# Altium schematic sheet CD4051BM_TR1_CD4051BM_TR.schdoc
size 124 x 99 mm
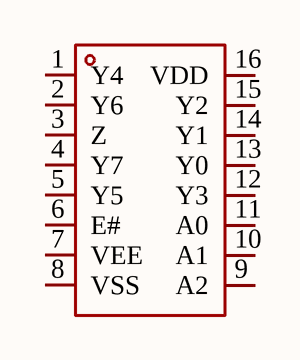
[diagram p0: CD4051BM_TR1_CD4051BM_TR.schdoc]

## Parts
U?  CD4051BM/TR  [SOP-16_L9.9-W3.9-P1.27-LS6.1-BL]  (value not drawn)

## Nets

Not connected (* = marked no-connect by the designer): U? 1(Y4) 2(Y6) 3(Z) 4(Y7) 5(Y5) 6(E#) 7(VEE) 8(VSS) 9(A2) 10(A1) 11(A0) 12(Y3) 13(Y0) 14(Y1) 15(Y2) 16(VDD)

## Library data of the parts
U? = CD4051BM/TR: Manufacturer: HGSEMI(华冠); Add into BOM: yes; Switch Circuit: 单刀八掷(SP8T); Number of Channels: 8; Supply Voltage: 3V~15V; On-State Resistance (Max): 60Ω; Symbol: CD4051BM/TR; Device: CD4051BM/TR; LCSC Part Name: CD4051B 单刀八掷模拟开关; Supplier Part: C507163; Manufacturer Part: CD4051BM/TR; Supplier Footprint: SOP-16; JLCPCB Part Class: Extended Part; Datasheet: https://atta.szlcsc.com/upload/public/pdf/source/20240320/7BB009024CA6631C42E25AC5CB4174DD.pdf; Supplier: LCSC; Convert to PCB: yes; Operating Temperature: -40℃~+85℃